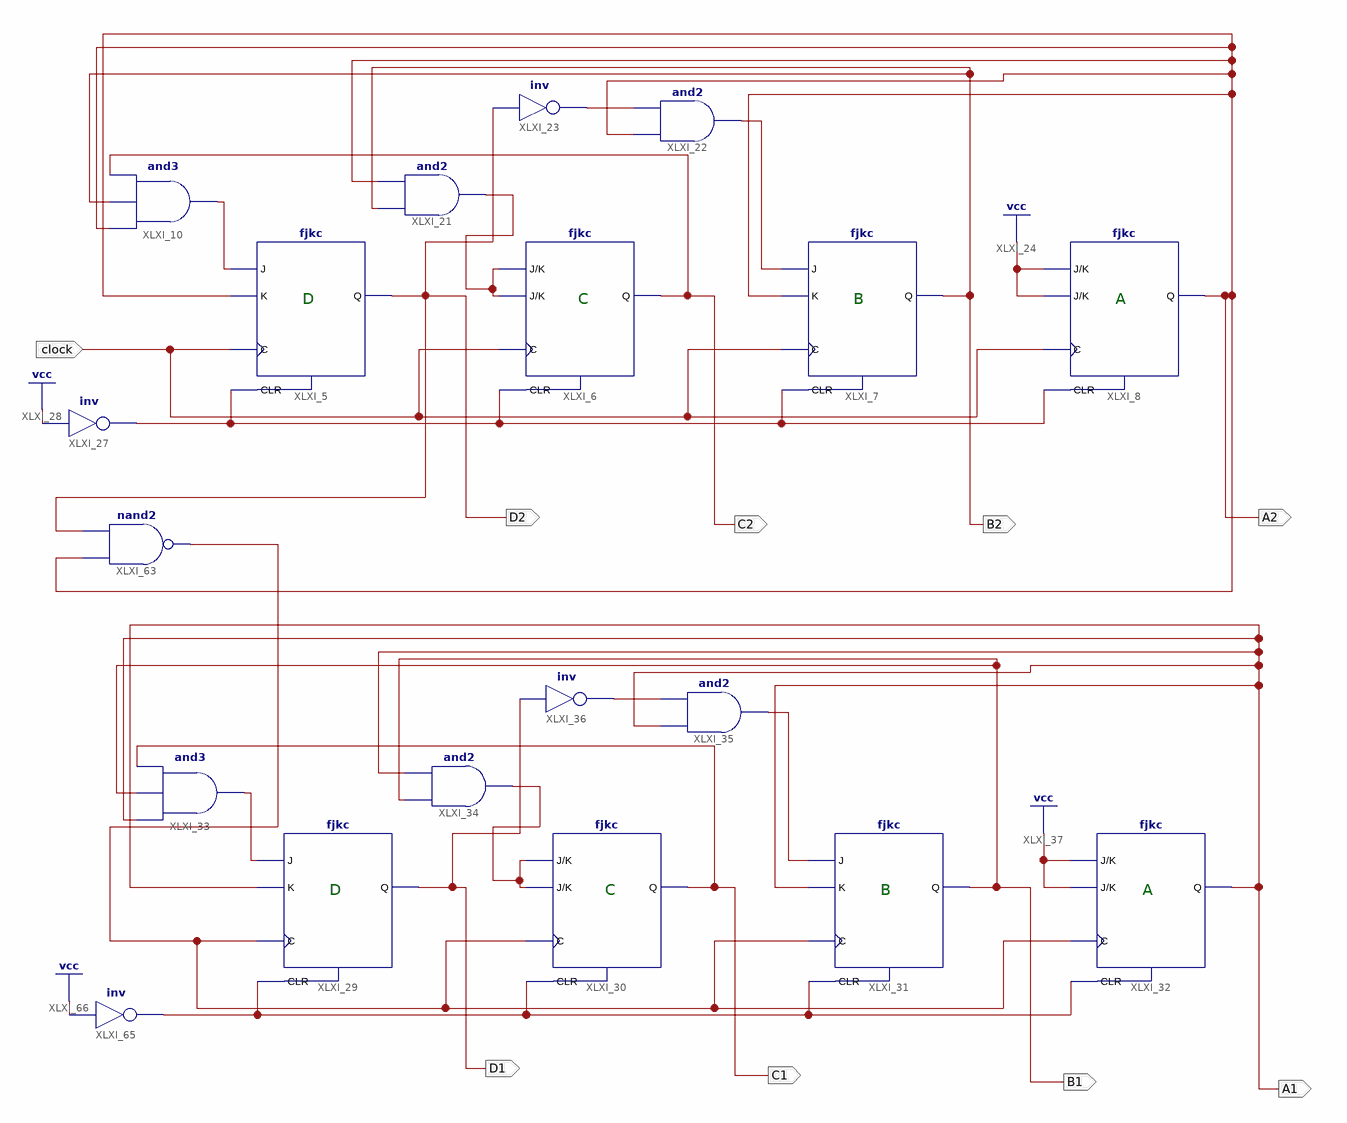
[diagram p0: schematic sheet 1]
// Xilinx ISE schematic counter0099.sch (spartan6) as structural Verilog: 19 symbols, 9 ports
module counter0099 (
  input  clock,
  output C1,
  output B1,
  output D1,
  output A1,
  output C2,
  output B2,
  output D2,
  output A2
);

  wire XLXN_71, XLXN_87, XLXN_89, XLXN_91, XLXN_102, XLXN_108, XLXN_110, XLXN_111, XLXN_118, XLXN_177,
       XLXN_181;

  fjkc XLXI_29 (.C(XLXN_118), .CLR(XLXN_181), .J(XLXN_102), .K(A1), .Q(D1));
  fjkc XLXI_30 (.C(XLXN_118), .CLR(XLXN_181), .J(XLXN_108), .K(XLXN_108), .Q(C1));
  fjkc XLXI_31 (.C(XLXN_118), .CLR(XLXN_181), .J(XLXN_111), .K(A1), .Q(B1));
  fjkc XLXI_32 (.C(XLXN_118), .CLR(XLXN_181), .J(1'b1), .K(1'b1), .Q(A1));
  and XLXI_33 (XLXN_102, A1, B1, C1);
  and XLXI_34 (XLXN_108, B1, A1);
  and XLXI_35 (XLXN_111, A1, XLXN_110);
  not XLXI_36 (XLXN_110, D1);
  fjkc XLXI_5 (.C(clock), .CLR(XLXN_177), .J(XLXN_71), .K(A2), .Q(D2));
  fjkc XLXI_6 (.C(clock), .CLR(XLXN_177), .J(XLXN_87), .K(XLXN_87), .Q(C2));
  fjkc XLXI_7 (.C(clock), .CLR(XLXN_177), .J(XLXN_91), .K(A2), .Q(B2));
  fjkc XLXI_8 (.C(clock), .CLR(XLXN_177), .J(1'b1), .K(1'b1), .Q(A2));
  and XLXI_10 (XLXN_71, A2, B2, C2);
  and XLXI_21 (XLXN_87, B2, A2);
  and XLXI_22 (XLXN_91, A2, XLXN_89);
  not XLXI_23 (XLXN_89, D2);
  not XLXI_27 (XLXN_177, 1'b1);
  nand XLXI_63 (XLXN_118, A2, D2);
  not XLXI_65 (XLXN_181, 1'b1);

  // Notes on the sheet:
  //   D
  //   C
  //   B
  //   A
  //   D
  //   C
  //   B
  //   A
endmodule
